# EAGLE schematic MXR Microamp (EAGLE 8.7.1)
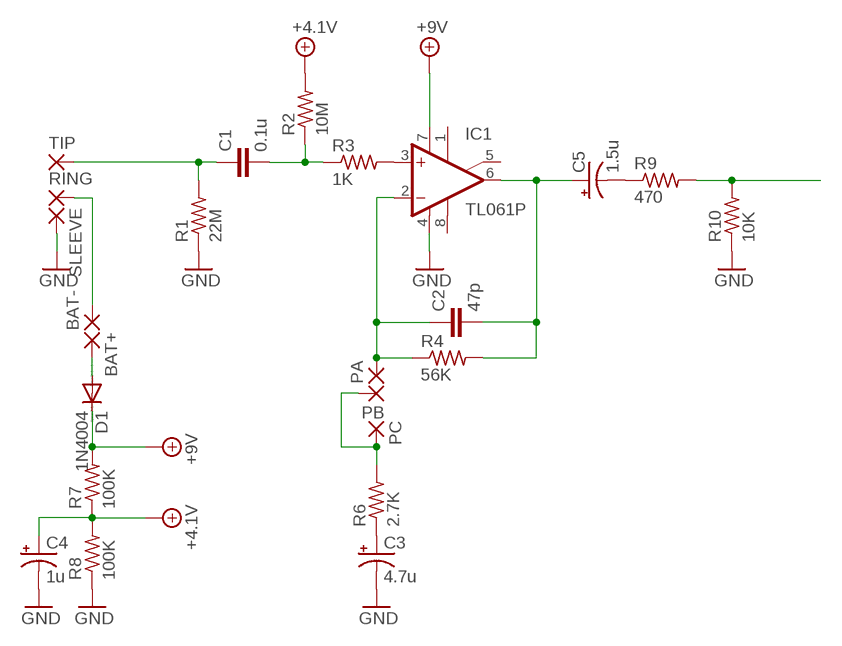
[diagram p0: schematic, sheet 1]

## Parts
BAT+  1,6/0,8  [1,6/0,8]
BAT-  1,6/0,8  [1,6/0,8]
C1  0.1u  C2,5-3  [C2.5-3]
C2  47p  C2,5-3  [C2.5-3]
C3  4.7u  CPOL-USE2.5-5  [E2,5-5]
C4  1u  CPOL-USE2.5-5  [E2,5-5]
C5  1.5u  CPOL-USE2.5-5  [E2,5-5]
D1  1N4004  [DO41-10]
IC1  TL061P  [DIL08]
PA  1,6/0,8  [1,6/0,8]
PB  1,6/0,8  [1,6/0,8]
PC  1,6/0,8  [1,6/0,8]
R1  22M  R-US_0207/7  [0207/7]
R2  10M  R-US_0207/7  [0207/7]
R3  1K  R-US_0207/7  [0207/7]
R4  56K  R-US_0207/7  [0207/7]
R6  2.7K  R-US_0207/7  [0207/7]
R7  100K  R-US_0207/7  [0207/7]
R8  100K  R-US_0207/7  [0207/7]
R9  470  R-US_0207/7  [0207/7]
R10  10K  R-US_0207/7  [0207/7]
RING  1,6/0,8  [1,6/0,8]
SLEEVE  1,6/0,8  [1,6/0,8]
TIP  1,6/0,8  [1,6/0,8]

## Nets
+4.1V: C4.+ R2.2 R7.1 R8.2
+9V: D1.C IC1.7(V+) R7.2
GND: C3.- C4.- IC1.4(V-) R1.1 R8.1 R10.1 SLEEVE.1(P)
N$1: IC1.3(+IN) R3.2
N$2: C2.2 C5.+ IC1.6(OUT) R4.2
N$3: C1.2 R2.1 R3.1
N$4: C1.1 R1.2 TIP.1(P)
N$5: C2.1 IC1.2(-IN) PA.1(P) R4.1
N$6: PB.1(P) PC.1(P) R6.2
N$7: C3.+ R6.1
N$8: BAT-.1(P) RING.1(P)
N$9: BAT+.1(P) D1.A
N$10: C5.- R9.1
N$11: R9.2 R10.2
Unconnected: IC1.1(ON1) IC1.5(ON2) IC1.8(OPT)

## Library data of the parts
BAT+ BAT- PA PB PC RING SLEEVE TIP = wirepad:1,6/0,8: THROUGH-HOLE PAD
C1 C2 = capacitor-wima:C: CAPACITOR naming: grid - package width
C3-C5 = rcl:CPOL-US: POLARIZED CAPACITOR, American symbol; SPICEPREFIX: C
D1 = diode:1N4004: DIODE general purpose rectifier, 1 A
IC1 = linear:TL061: OP AMP
R1-R4 R6-R10 = rcl:R-US_: RESISTOR, American symbol; SPICEPREFIX: R